# EAGLE design AST1008 (EAGLE 6.3)
DATABASE: ./../../../../../Components/TinyCircuits_Part_Database.txt
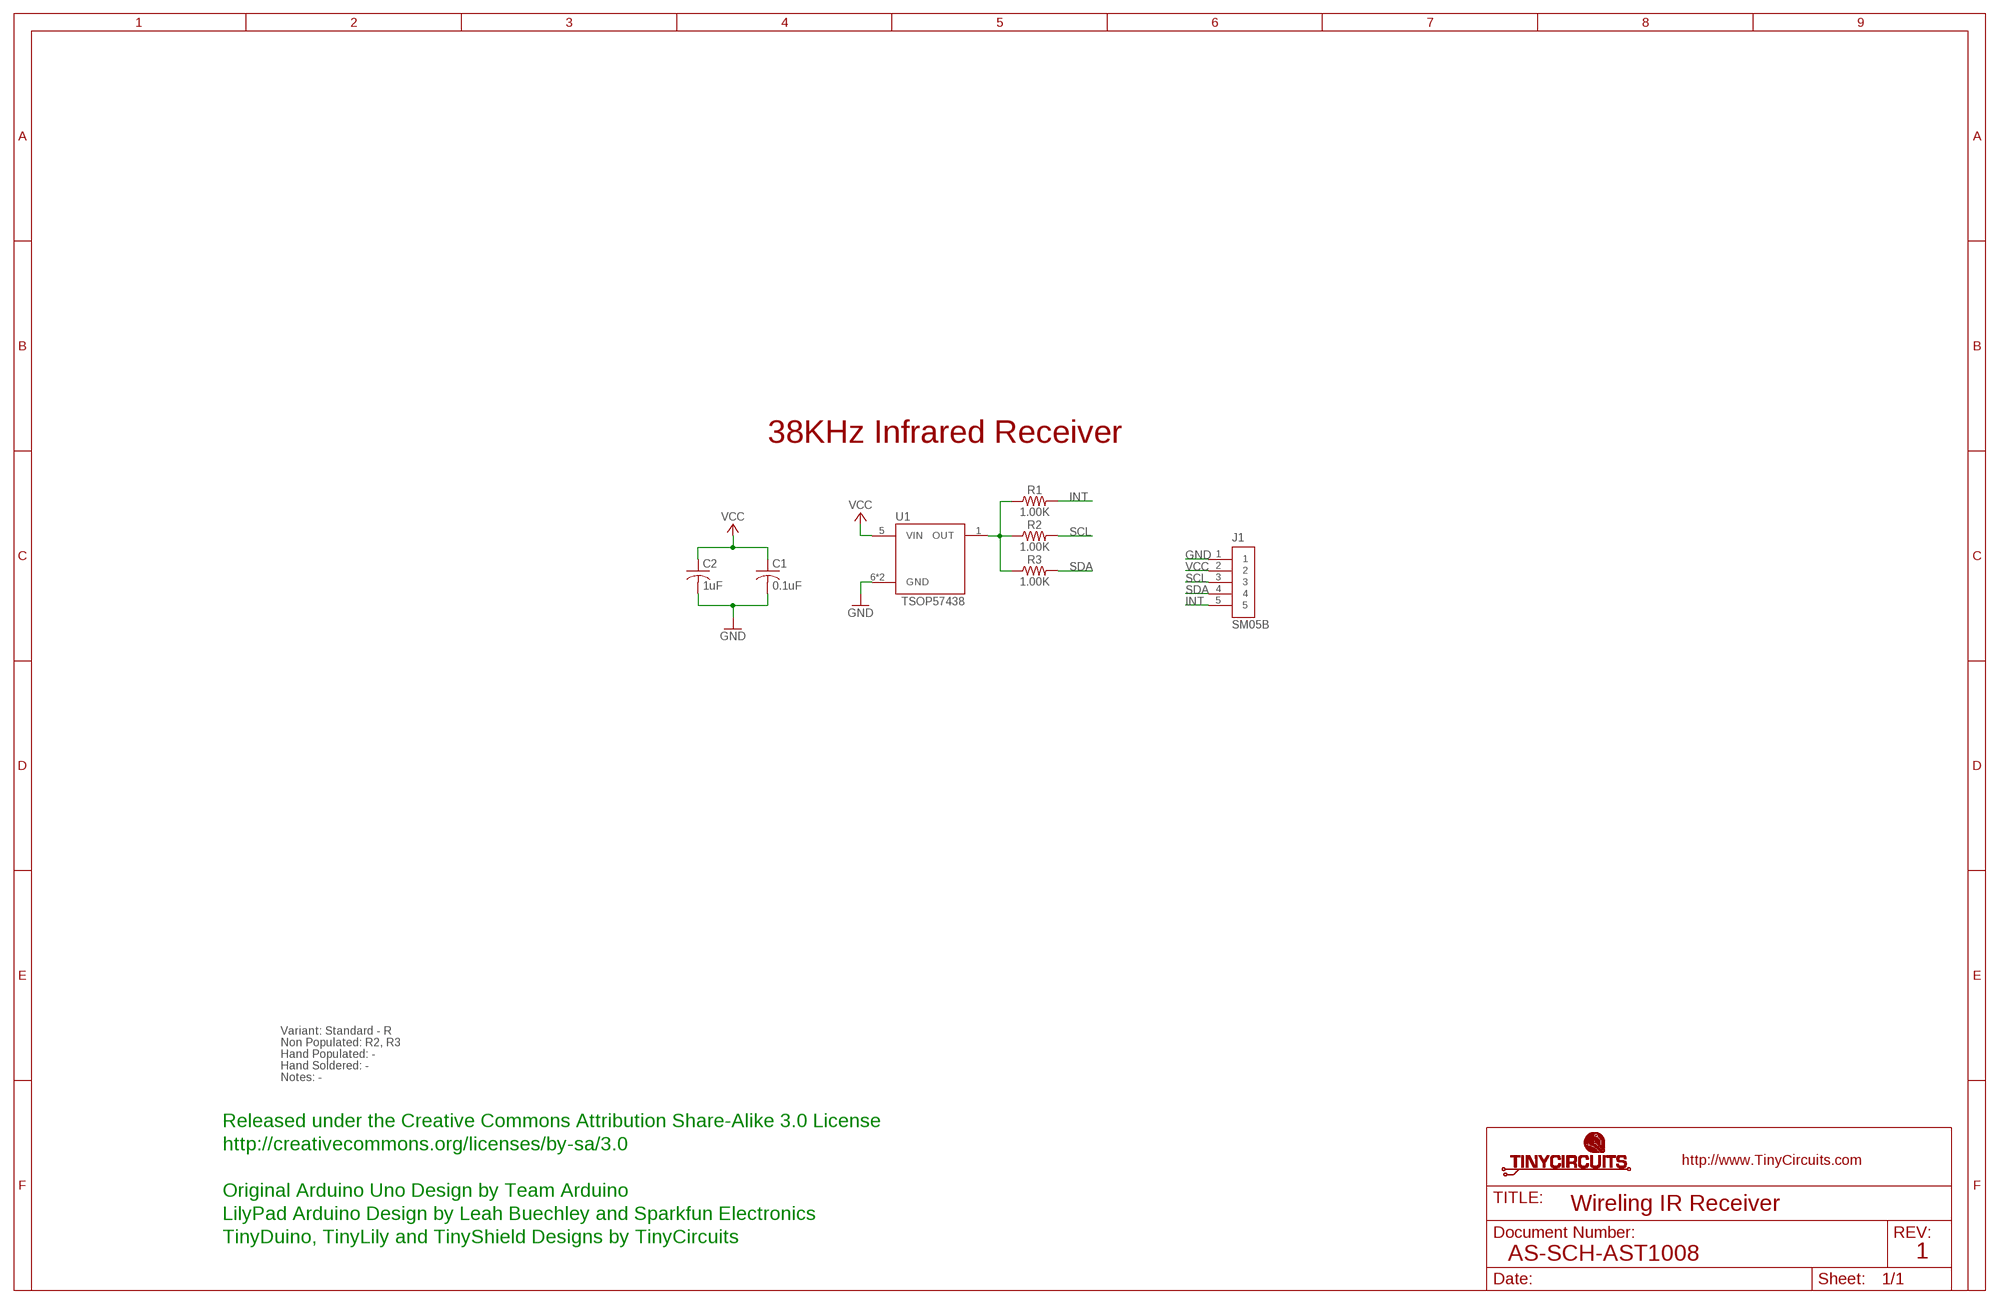
[diagram p0: schematic, sheet 1]

## Parts
C1  0.1uF  AS-ITM-00008  [C0402]
C2  1uF  AS-ITM-00410  [C0603]
J1  SM05B  AS-ITM-00340EDGE  [JST_SH_5X1_EDGE]
R1  1.00K  AS-ITM-00003  [0402]
R2  1.00K  AS-ITM-00003  [0402]
R3  1.00K  AS-ITM-00003  [0402]
U1  TSOP57438  AS-ITM-00360  [TSOP57]

## Nets
GND: C1.2 C2.2 J1.1 U1.6(GND) U1.8(GND)
GPIO1: R1.1 R2.1 R3.1 U1.1(OUT)
INT: J1.5 R1.2
SCL: J1.3 R2.2
SDA: J1.4 R3.2
VCC: C1.1 C2.1 J1.2 U1.5(VIN)

## Notes on the sheet
- 38KHz Infrared Receiver
- Variant: Standard - R
- Non Populated: R2, R3
- Hand Populated: -
- Hand Soldered: -
- Notes: -
- Released under the Creative Commons Attribution Share-Alike 3.0 License
- http://creativecommons.org/licenses/by-sa/3.0
- Original Arduino Uno Design by Team Arduino
- Wireling IR Receiver
- LilyPad Arduino Design by Leah Buechley and Sparkfun Electronics
- TinyDuino, TinyLily and TinyShield Designs by TinyCircuits
- AS-SCH-AST1008 | 1

## Library data of the parts
C1 = tinycircuits:AS-ITM-00008: CAP CER 0.1UF 16V 10% X5R 0402; PARTNO: AS-ITM-00008
C2 = tinycircuits:AS-ITM-00410: CAP CER 1UF 10V X5R 0603; PARTNO: AS-ITM-00410
J1 = tinycircuits:AS-ITM-00340: CONN HEADER SH 5POS SIDE 1MM TIN; PARTNO: AS-ITM-00340; PNPROTATION: 180
R1-R3 = tinycircuits:AS-ITM-00003: RES 1.00K OHM 1/16W 1% 0402; PARTNO: AS-ITM-00003
U1 = tinycircuits:AS-ITM-00360: IC IR RCVR MOD 38KHZ; PARTNO: AS-ITM-00360

## Net classes
2 gnd: width 0.305 mm, drill 0.559 mm, clearance 0.254 mm

## Board
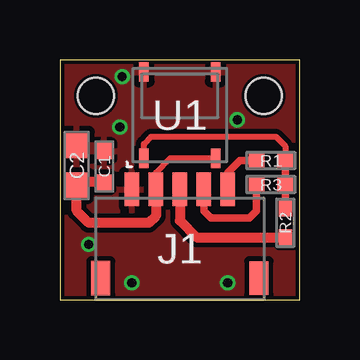
[diagram p1: board, top side]
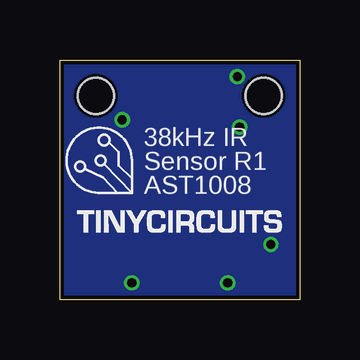
[diagram p2: board, bottom side, seen from below]

Size 10 x 10 mm. Coordinates in mm from the lower left corner, seen from the top.
Outline: 0,0 10,0 10,10 0,10 0,0
Copper layers (1*16): Top 0.035mm / dielectric 1.5mm / Bottom 0.035mm
Design rules "default *": minimum track width 8mil, minimum drill 15mil, track to track 8mil, track to pad 8mil, pad to pad 8mil, via to via 8mil, smd to smd 8mil, copper to edge 6mil, drill to drill 8mil, minimum pad ring 8mil, minimum via ring 5mil, stop-mask expansion 4mil, vias tented up to drill 25mil, thermal gap 10mil
Holes 1.5 mm at 1.5,8.5 8.5,8.5

### Footprints (pad centres in the part's own frame; a part is rotated, then mirrored left to right if it is on the bottom)
C0402 = smd 0.65 x 0.6: 1 -0.65,0; 2 0.65,0
C0603 = smd 1.1 x 1: 1 -0.85,0; 2 0.85,0
JST_SH_5X1_EDGE = smd 0.6 x 1.4: 1 -2,2.475; 2 -1,2.475; 3 0,2.475; 4 1,2.475; 5 2,2.475 | smd 0.8 x 1.4: PAD1 -3.3,-1.225; PAD2 3.3,-1.225
0402 = smd 0.65 x 0.55: 1 -0.6,0; 2 0.6,0
TSOP57 = smd 0.4 x 0.8: 1 -1.5,-1.8; 5 1.5,-1.8; 6 1.5,1.8; 8 -1.5,1.8

### Placement (x,y rotation side)
C1  1.85,5.55 90 top
C2  0.7,5.6 90 top
J1  5,2.12 0 top
R1  8.8,5.8 180 top
R2  9.4,3.2 270 top
R3  8.8,4.8 180 top
U1  5,7.7 0 top
U$1  [DOCFIELD-TINYCIRCUITS-PCB]  19,-10 0 top  (outside the outline)

### Tracks (layer width: path | path; a pad name or v marks a point on that pad's centre or on a via)
GND  (via drill 0.38)
  other vias: 1.2,2.3 3,0.7 7,0.7 2.6,9.3 7.4,7.5 2.5,7.2
  pour Bottom: 0,10 10,10 10,0 0,0
  pour Top: 0,10 10,10 10,0 0,0
GPIO1
  Top 0.254: U1.1 3.5,6.5 3.8,6.8 9,6.8 9.4,6.4 R1.1
  Top 0.305: R2.1 R3.1 R1.1
INT
  Top 0.305: J1.5 7,5.3 7.5,5.8 R1.2
SCL
  Top 0.406: J1.3 5,3.3 5.7,2.6 R2.2
SDA
  Top 0.305: J1.4 6,3.7 6.3,3.4 7.9,3.4 8.2,3.7 R3.2
VCC
  Top 0.254: J1.2 4,5.3 4.6,5.9 U1.5 | C2.1 0.7,4.8
  Top 0.305: 0.95,5 C2.1
  Top 0.406: J1.2 4,3.5 3.7,3.2 1.2,3.2 0.7,3.7 C2.1 0.85,4.9 C1.1

### Text on the board
bPlace: 38kHz IR | Sensor R1 | AST1008
Document: FABRICATION DRAWING | NOTES: | 1. PRINTED CIRCUIT BOARD MADE FROM NEMA GRADE FR-4 EPOXY LAMINATE | WITH 1 OUNCE COPPER PLATING AND .024 THICKNESS. | 2. ALL DIMENSIONS ARE GIVEN IN MILLIMETERS. | 3. CIRCUIT PATHS ARE FOR REFERENCE ONLY. | 4. HOLE SIZES SHOWN ARE FINISHED DIAMETERS AFTER PLATING. | 5. BOARD PLATED USING REFLOW OR SIMILAR METHOD. | 6. BOARD TO HAVE BLUE SOLDER MASK ON PLATED SURFACES USING WET FILM | 7. SILKSCREEN BOARD USING WHITE INK. | SR100 OR SR1010 EPOXY. EQUIVALENT WET OR DRY FILM MAY BE USED. | 8. THE FOLLOWING INFORMATION APPLIES TO THIS BOARD: | * 2 COPPER LAYERS | * .024 BOARD THICKNESS | * REQUIRES TOP SIDE SILKSCREEN | Released under the Creative Commons Attribution Share-Alike 3.0 License | http://creativecommons.org/licenses/by-sa/3.0 | Original Arduino Uno Design by Team Arduino | LilyPad Arduino Design by Leah Buechley and Sparkfun Electronics | TinyDuino, TinyLily and TinyShield Designs by TinyCircuits | Wireling IR Receiver | AS-PCB-AST1008 | 1